# Altium schematic sheet fmc_digital_io_fmc_connector.SchDoc: FMC
size 420 x 297 mm; EDA_Number: EDA-02064-V1-0; Projet: FmcDIO16chTTLa; CheckedBy: MK; Author: G.K.; CompanyName: CREOTECH; DrawnBy: G.K.; Organization: CTI SA; Address1: Creotech Instruments SA; Address2: Okulickiego 7/9, 05-500 Poland; DocumentNumber: 26; Revision: -; SheetNumber: 26; SheetTotal: 29; ModifiedBy: -; CreateDate: XX/XX/XXXX; CheckedDate: -; Title2: connector; DivGrp: CTI; Designer: G.K.; ModifiedDate: -; ProjectName: FMC LVDS 32
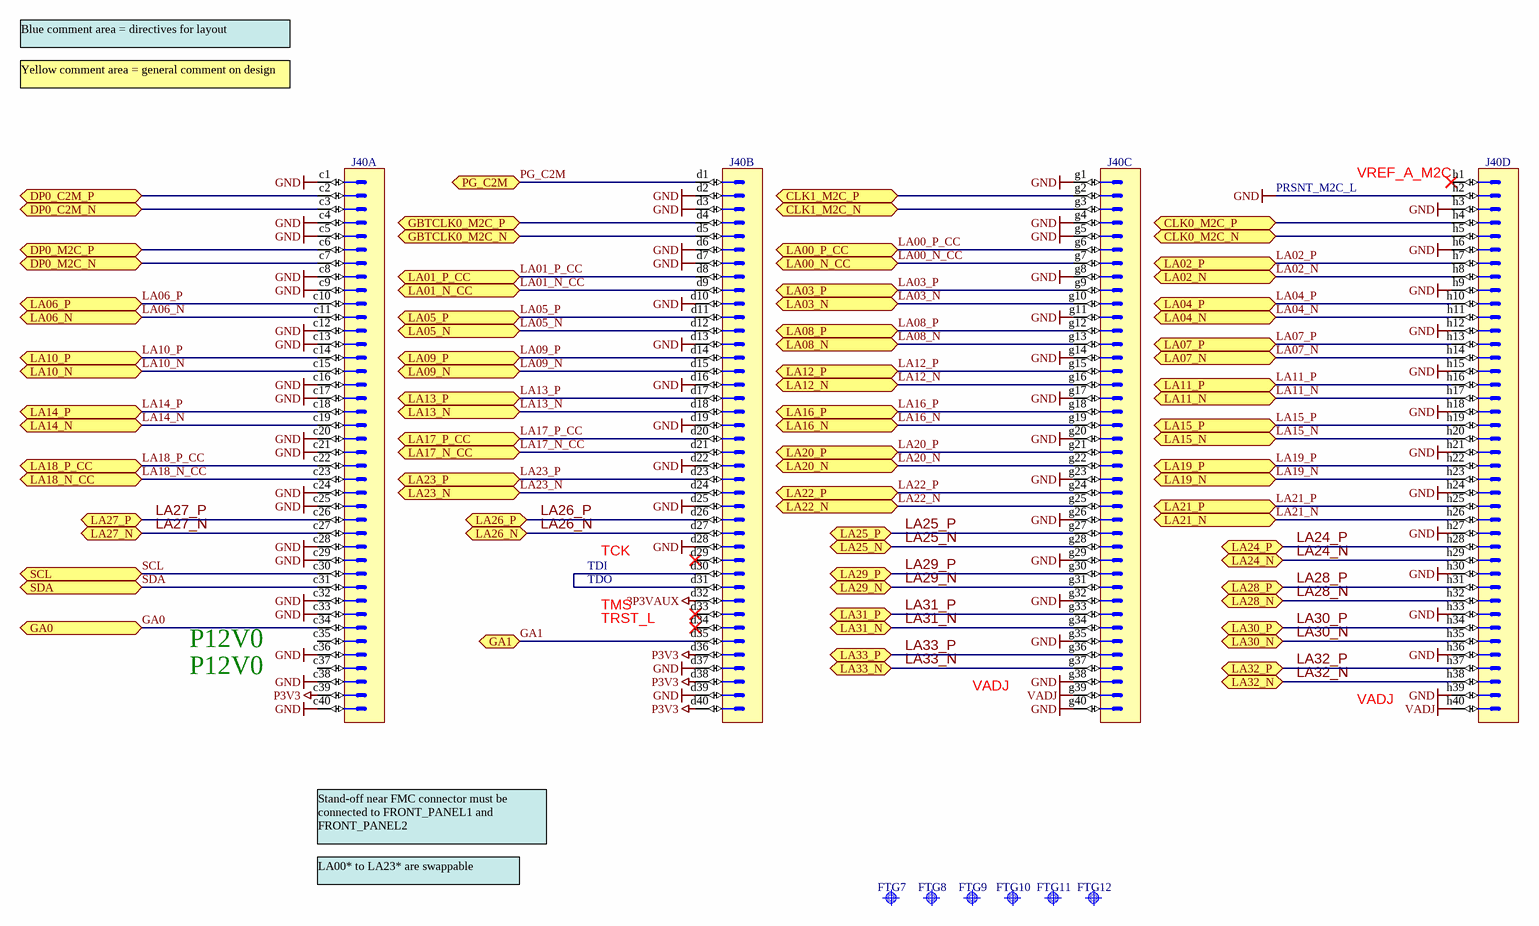
[diagram p0: fmc_digital_io_fmc_connector.SchDoc]

## Parts
FTG7  Use only in PCB  [FIDUCIAL_TOP_S100-200]  (value not drawn)
FTG8  Use only in PCB  [FIDUCIAL_TOP_S100-200]  (value not drawn)
FTG9  Use only in PCB  [FIDUCIAL_TOP_S100-200]  (value not drawn)
FTG10  Use only in PCB  [FIDUCIAL_TOP_S100-200]  (value not drawn)
FTG11  Use only in PCB  [FIDUCIAL_TOP_S100-200]  (value not drawn)
FTG12  Use only in PCB  [FIDUCIAL_TOP_S100-200]  (value not drawn)
J40  VITA 57  [SAMTEC_ASP-127797-01]  (value not drawn)  (parts A,B,C,D of 4)

## Ports
CLK0_M2C_N (bidir), CLK0_M2C_P (bidir), CLK1_M2C_N (bidir), CLK1_M2C_P (bidir), DP0_C2M_N (bidir), DP0_C2M_P (bidir), DP0_M2C_N (bidir), DP0_M2C_P (bidir), GA0 (bidir), GA1 (bidir), GBTCLK0_M2C_N (bidir), GBTCLK0_M2C_P (bidir), LA00_N_CC (bidir), LA00_P_CC (bidir), LA01_N_CC (bidir), LA01_P_CC (bidir), LA02_N (bidir), LA02_P (bidir), LA03_N (bidir), LA03_P (bidir), LA04_N (bidir), LA04_P (bidir), LA05_N (bidir), LA05_P (bidir), LA06_N (bidir), LA06_P (bidir), LA07_N (bidir), LA07_P (bidir), LA08_N (bidir), LA08_P (bidir), LA09_N (bidir), LA09_P (bidir), LA10_N (bidir), LA10_P (bidir), LA11_N (bidir), LA11_P (bidir), LA12_N (bidir), LA12_P (bidir), LA13_N (bidir), LA13_P (bidir), LA14_N (bidir), LA14_P (bidir), LA15_N (bidir), LA15_P (bidir), LA16_N (bidir), LA16_P (bidir), LA17_N_CC (bidir), LA17_P_CC (bidir), LA18_N_CC (bidir), LA18_P_CC (bidir), LA19_N (bidir), LA19_P (bidir), LA20_N (bidir), LA20_P (bidir), LA21_N (bidir), LA21_P (bidir), LA22_N (bidir), LA22_P (bidir), LA23_N (bidir), LA23_P (bidir), LA24_N (bidir), LA24_P (bidir), LA25_N (bidir), LA25_P (bidir), LA26_N (bidir), LA26_P (bidir), LA27_N (bidir), LA27_P (bidir), LA28_N (bidir), LA28_P (bidir), LA29_N (bidir), LA29_P (bidir), LA30_N (bidir), LA30_P (bidir), LA31_N (bidir), LA31_P (bidir), LA32_N (bidir), LA32_P (bidir), LA33_N (bidir), LA33_P (bidir), PG_C2M (bidir), SCL (bidir), SDA (bidir)

## Nets
3P3VAUX: J40.d32
GND: J40.c1 J40.c4 J40.c5 J40.c8 J40.c9 J40.c12 J40.c13 J40.c16 J40.c17 J40.c20 J40.c21 J40.c24 J40.c25 J40.c28 J40.c29 J40.c32 J40.c33 J40.c36 J40.c38 J40.c40 J40.d2 J40.d3 J40.d6 J40.d7 J40.d10 J40.d13 J40.d16 J40.d19 J40.d22 J40.d25 J40.d28 J40.d37 J40.d39 J40.g1 J40.g4 J40.g5 J40.g8 J40.g11 J40.g14 J40.g17 J40.g20 J40.g23 J40.g26 J40.g29 J40.g32 J40.g35 J40.g38 J40.g40 J40.h2 J40.h3 J40.h6 J40.h9 J40.h12 J40.h15 J40.h18 J40.h21 J40.h24 J40.h27 J40.h30 J40.h33 J40.h36 J40.h39
P3V3: J40.c39 J40.d36 J40.d38 J40.d40
VADJ: J40.g39 J40.h40
CLK0_M2C_N: J40.h5 ; port CLK0_M2C_N
CLK0_M2C_P: J40.h4 ; port CLK0_M2C_P
CLK1_M2C_N: J40.g3 ; port CLK1_M2C_N
CLK1_M2C_P: J40.g2 ; port CLK1_M2C_P
DP0_C2M_N: J40.c3 ; port DP0_C2M_N
DP0_C2M_P: J40.c2 ; port DP0_C2M_P
DP0_M2C_N: J40.c7 ; port DP0_M2C_N
DP0_M2C_P: J40.c6 ; port DP0_M2C_P
GA0: J40.c34 ; port GA0
GA1: J40.d35 ; port GA1
GBTCLK0_M2C_N: J40.d5 ; port GBTCLK0_M2C_N
GBTCLK0_M2C_P: J40.d4 ; port GBTCLK0_M2C_P
LA00_N_CC: J40.g7 ; port LA00_N_CC
LA00_P_CC: J40.g6 ; port LA00_P_CC
LA01_N_CC: J40.d9 ; port LA01_N_CC
LA01_P_CC: J40.d8 ; port LA01_P_CC
LA02_N: J40.h8 ; port LA02_N
LA02_P: J40.h7 ; port LA02_P
LA03_N: J40.g10 ; port LA03_N
LA03_P: J40.g9 ; port LA03_P
LA04_N: J40.h11 ; port LA04_N
LA04_P: J40.h10 ; port LA04_P
LA05_N: J40.d12 ; port LA05_N
LA05_P: J40.d11 ; port LA05_P
LA06_N: J40.c11 ; port LA06_N
LA06_P: J40.c10 ; port LA06_P
LA07_N: J40.h14 ; port LA07_N
LA07_P: J40.h13 ; port LA07_P
LA08_N: J40.g13 ; port LA08_N
LA08_P: J40.g12 ; port LA08_P
LA09_N: J40.d15 ; port LA09_N
LA09_P: J40.d14 ; port LA09_P
LA10_N: J40.c15 ; port LA10_N
LA10_P: J40.c14 ; port LA10_P
LA11_N: J40.h17 ; port LA11_N
LA11_P: J40.h16 ; port LA11_P
LA12_N: J40.g16 ; port LA12_N
LA12_P: J40.g15 ; port LA12_P
LA13_N: J40.d18 ; port LA13_N
LA13_P: J40.d17 ; port LA13_P
LA14_N: J40.c19 ; port LA14_N
LA14_P: J40.c18 ; port LA14_P
LA15_N: J40.h20 ; port LA15_N
LA15_P: J40.h19 ; port LA15_P
LA16_N: J40.g19 ; port LA16_N
LA16_P: J40.g18 ; port LA16_P
LA17_N_CC: J40.d21 ; port LA17_N_CC
LA17_P_CC: J40.d20 ; port LA17_P_CC
LA18_N_CC: J40.c23 ; port LA18_N_CC
LA18_P_CC: J40.c22 ; port LA18_P_CC
LA19_N: J40.h23 ; port LA19_N
LA19_P: J40.h22 ; port LA19_P
LA20_N: J40.g22 ; port LA20_N
LA20_P: J40.g21 ; port LA20_P
LA21_N: J40.h26 ; port LA21_N
LA21_P: J40.h25 ; port LA21_P
LA22_N: J40.g25 ; port LA22_N
LA22_P: J40.g24 ; port LA22_P
LA23_N: J40.d24 ; port LA23_N
LA23_P: J40.d23 ; port LA23_P
LA24_N: J40.h29 ; port LA24_N
LA24_P: J40.h28 ; port LA24_P
LA25_N: J40.g28 ; port LA25_N
LA25_P: J40.g27 ; port LA25_P
LA26_N: J40.d27 ; port LA26_N
LA26_P: J40.d26 ; port LA26_P
LA27_N: J40.c27 ; port LA27_N
LA27_P: J40.c26 ; port LA27_P
LA28_N: J40.h32 ; port LA28_N
LA28_P: J40.h31 ; port LA28_P
LA29_N: J40.g31 ; port LA29_N
LA29_P: J40.g30 ; port LA29_P
LA30_N: J40.h35 ; port LA30_N
LA30_P: J40.h34 ; port LA30_P
LA31_N: J40.g34 ; port LA31_N
LA31_P: J40.g33 ; port LA31_P
LA32_N: J40.h38 ; port LA32_N
LA32_P: J40.h37 ; port LA32_P
LA33_N: J40.g37 ; port LA33_N
LA33_P: J40.g36 ; port LA33_P
PG_C2M: J40.d1 ; port PG_C2M
SCL: J40.c30 ; port SCL
SDA: J40.c31 ; port SDA
NetJ40_d30: J40.d30 J40.d31

Not connected (* = marked no-connect by the designer): J40 c35 c37 d29* d33* d34* h1*

## Notes on the sheet
- Blue comment area = directives for layout
- Yellow comment area = general comment on design
- (near J40) VREF_A_M2C
- PRSNT_M2C_L
- TDI
- TDO
- TCK
- P12V0
- TMS
- TRST_L
- VADJ
- Stand-off near FMC connector must be connected to FRONT_PANEL1 and FRONT_PANEL2
- LA00* to LA23* are swappable
- Project/Equipment
- Document
- Designer
- Drawn by
- Check.by
- Copyright Creotech Instruments SA 2014.
  This documentation describes Open Hardware and is licensed under the CERN OHL v.1.1. You may redistribute and modify this documentation under the terms of the CERN OHL v.1.1. (http://ohwr.org/CERNOHL). This documentation is distributed WITHOUT ANY EXPRESS OR IMPLIED WARRANTY, INCLUDING OF MERCHANTABILITY, SATISFACTORY QUALITY AND FITNESS FOR A PARTICULAR PURPOSE. Please see the CERN OHL v.1.1 for applicable conditions.
- File
- Last Mod.
- Print Date
- Sheet
- Size
- A3
- of
- Rev

## Library data of the parts
FTG7-FTG12 = FIDUCIAL_TARGET_S100-200: Fiducial Target; Part Description: Scare Fiducial Target, Top Layer, 1.0mm, Top Sloder 2.0mm, Keepout =2.0mm; Mounted: No; Table: Pads; Part Number: FIDUCIAL_TARGET_S100-200; Component Kind: Standard (No BOM); Component Type: Standard (No BOM); Pin Count: 1; Family: Fiducial; Socket: No; SMD: Yes; Status: None; ComponentHeight: 0mm; Author: CERN DEM JLC; CreateDate: 09.02.2010; LatestRevisionDate: 09.02.2010; PackageDescription: Scare Fiducial Target, Top Layer, 1.0mm, Top Sloder 2.0mm, Keepout =2.0mm
J40 = SAMTEC_ASP-127797-01: Connector VITA 57, 160 Male contacts in 4 row cdgh; Part Description: 160 contacts (4 rows cdgh) Surface Mount Male Connector, VITA 57; Manufacturer: SAMTEC; Manufacturer Part Number: ASP-134488-01; Part Number: SAMTEC_ASP-127797-01; Component Kind: Standard; Component Type: Standard; Designator: Connector VITA 57 160 Male (cdgh); Library Reference: Connector VITA 57 160 Male (cdgh); Pin Count: 160; Family: VITA 57; Mounted: Yes; Socket: No; SMD: Yes; Status: None; ComponentHeight: 6.1mm; Datasheet: \\cern.ch\dfs\Applications\Altium\Datasheets\SAMTEC_ASP-127797-01.pdf; HelpURL: \\cern.ch\dfs\Applications\Altium\Datasheets\SAMTEC_ASP-127797-01.pdf; Author: CERN DEM JLC; CreateDate: 9/24/2009; LatestRevisionDate: 9/24/2009; Table: SAMTEC